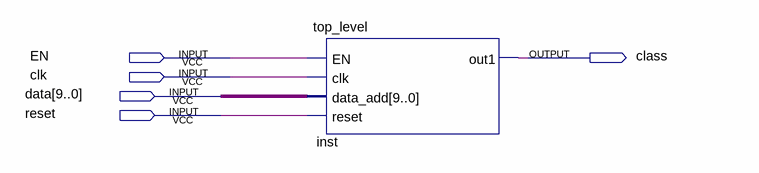
[diagram p0: schematic sheet]
// Quartus schematic top_final.bdf as structural Verilog: 1 symbols, 5 pins
module top_final (
  input  EN,
  input  clk,
  input  [9:0] data,
  input  reset,
  output \class 
);

  top_level inst (.EN(EN), .clk(clk), .data_add(data), .reset(reset), .out1(\class ));
endmodule
